# EAGLE design zap-1V5 (EAGLE 6.4)
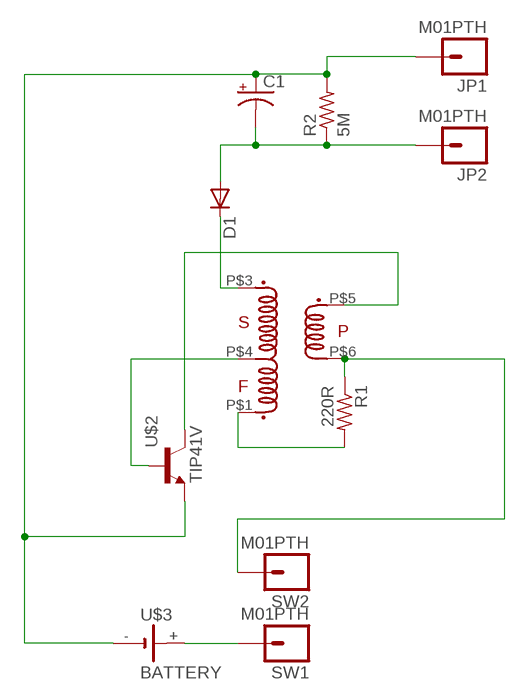
[diagram p0: schematic, sheet 1]

## Parts
C1  CAPACITOR_POL  [E5-10,5-SIDE]
D1  DIODEPTH  [DIODE-1N4001]
JP1  M01PTH  [1X01]
JP2  M01PTH  [1X01]
R1  220R  RESISTOR0207/2V  [0207/2V]
R2  5M  RESISTOR0207/7  [0207/7]
SW1  M01PTH  [1X01]
SW2  M01PTH  [1X01]
U$1  XFT-FLYBACK3V  [XFT-FLYBACK]
U$2  TIP41V  [TO220V]
U$3  BATTERY  [A90]

## Nets
N$1: C1.P$1(+) JP1.1 R2.2 U$2.3(E) U$3.-
N$2: C1.P$2(-) D1.A JP2.1 R2.1
N$3: D1.C U$1.P$3(P$1.S)
N$4: R1.1 SW2.1 U$1.P$6(P$5.P2)
N$5: SW1.1 U$3.+
N$6: R1.2 U$1.P$1(P$3.F)
N$7: U$1.P$4(P$2.CENTRE) U$2.1(B)
N$8: U$1.P$5(P$4.P1) U$2.2(C)

## Library data of the parts
C1 = iStivi - RCLD:CAPACITOR_POL: POLARIZED CAPACITOR, American symbol
D1 = iStivi - RCLD:DIODE: Diode These are standard reverse protection diodes and small signal diodes.
JP1 JP2 SW1 SW2 = iStivi - Header-Connector:M01: Header 1 Standard 1-pin 0.1" header. Use with straight break away headers (SKU : PRT-00116), right angle break away headers (PRT-00553), swiss pins (PRT-00743), machine pins (PRT-00117), and female headers (PRT-00115).
R1 R2 = iStivi - RCLD:RESISTOR: RESISTOR
U$1 = iStivi - Transformers:XFT-FLYBACK: XFT Flyback transformer
U$2 = iStivi - Transistor-FET-reg:TIP41: TIP41 NPN power transistor
U$3 = iStivi - Supply:BATTERY: Battery Battery footprints

## Board
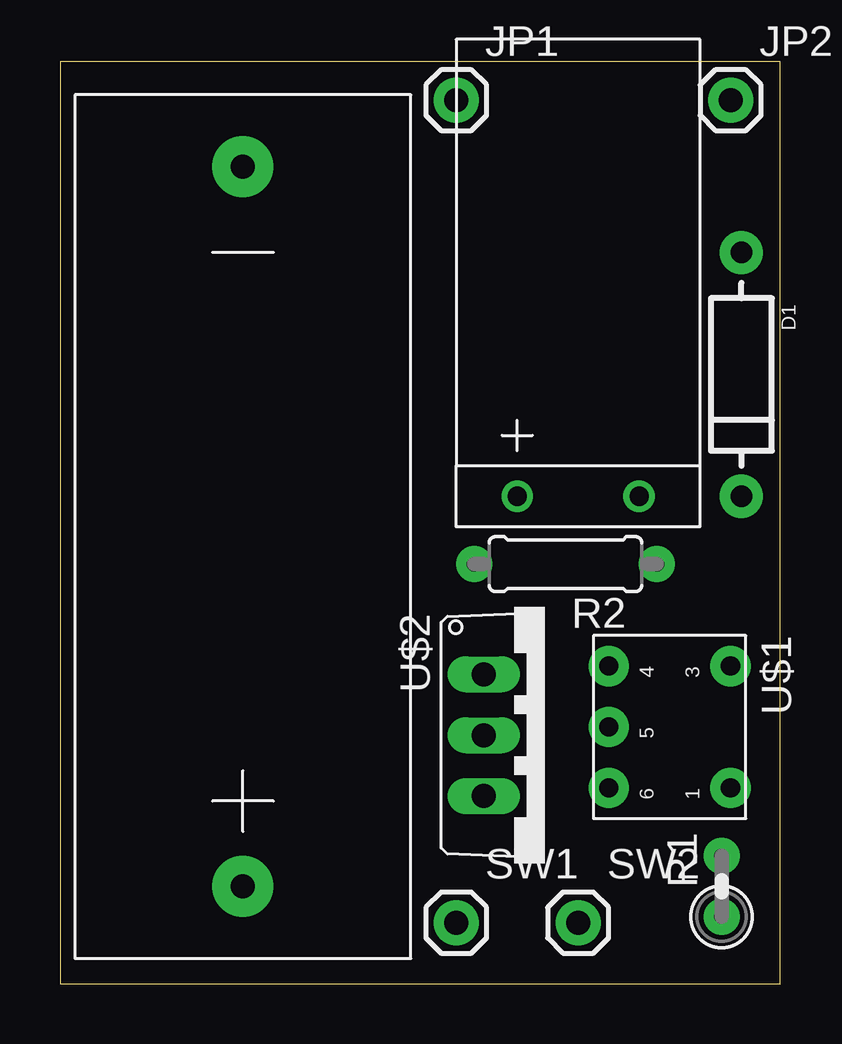
[diagram p1: board, top side]
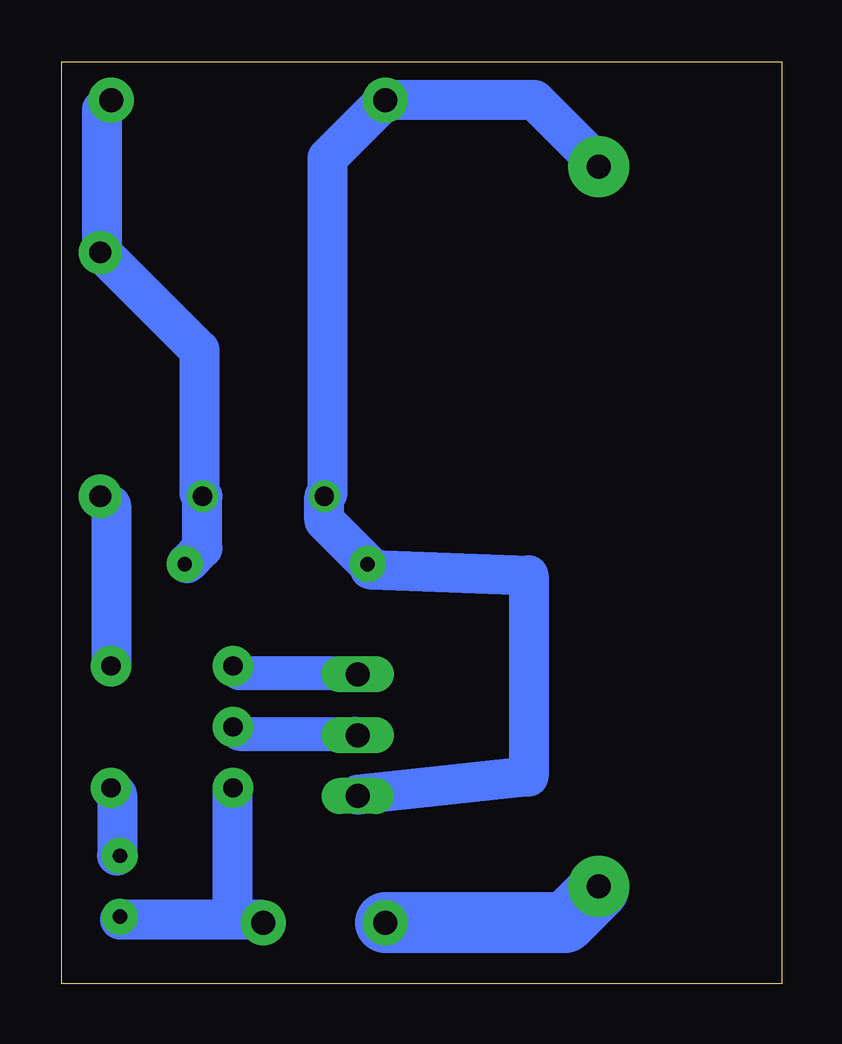
[diagram p2: board, bottom side, seen from below]

Size 30 x 38.43 mm. Coordinates in mm from the lower left corner, seen from the top.
Outline: 0,0 30,0 30,38.43 0,38.43 0,0
Copper layers (1*16): Top 0.035mm / dielectric 1.5mm / Bottom 0.035mm
Design rules "zap *": minimum track width 0.5mm, minimum drill 0.6mm, track to track 0.205mm, track to pad 0.205mm, pad to pad 0.205mm, via to via 0.205mm, smd to smd 8mil, copper to edge 0.3mm, drill to drill 8mil, minimum pad ring 10mil, minimum via ring 8mil, stop-mask expansion 4mil, vias tented up to drill 0mil, thermal gap 10mil

### Footprints (pad centres in the part's own frame; a part is rotated, then mirrored left to right if it is on the bottom)
E5-10,5-SIDE = drill 0.8: P$1 0,2.54; P$2 0,-2.54
DIODE-1N4001 = drill 0.9 pad 1.8: A -5.08,0; C 5.08,0
1X01 = drill 1 pad 1.88: 1 0,0
0207/2V = drill 0.6 pad 1.5: 1 -1.27,0; 2 1.27,0
0207/7 = drill 0.6 pad 1.5: 1 -3.81,0; 2 3.81,0
XFT-FLYBACK = drill 0.8 pad 1.676: P$1 2.54,2.54; P$3 -2.54,2.54; P$4 -2.54,-2.54; P$5 0,-2.54; P$6 2.54,-2.54
TO220V = drill 1 long: 1 -2.54,-2.54; 2 0,-2.54; 3 2.54,-2.54
A90 = drill 1 pad 2.54: + 0,15; - 0,-15

### Placement (x,y rotation side)
C1  21.59,20.32 90 top
D1  28.39,25.4 270 top
JP1  16.51,36.83 0 top
JP2  27.94,36.83 0 top
R1  27.57,4.06 90 top
R2  21.06,17.49 180 top
SW1  16.51,2.54 0 top
SW2  21.59,2.54 0 top
U$1  25.4,10.7 270 top
U$2  20.2,10.36 270 top
U$3  7.62,19.05 180 top

### Tracks (layer width: path | path; a pad name or v marks a point on that pad's centre or on a via)
N$1
  Bottom 0.5: 17.27,17.53 R2.2 17.14,17.27 | 17.65,7.87 U$2.3 | 7.62,34.16 U$3.-
  Bottom 1.422: 18.92,20.45 C1.P$1
  Bottom 1.676: C1.P$1 19.05,19.3 17.27,17.53 | 17.65,7.87 10.54,8.64 10.54,17.02 17.14,17.27 | 7.62,34.16 10.29,36.83 JP1.1 18.92,34.42 18.92,20.45
N$2
  Bottom 0.5: 24.77,17.53 R2.1 | JP2.1 28.32,36.45 | 28.32,30.48 D1.A 28.19,30.35 | 24.26,20.45 C1.P$2
  Bottom 1.676: C1.P$2 24.13,18.16 24.77,17.53 | 28.32,36.45 28.32,30.48 | 24.26,20.45 24.26,26.42 28.19,30.35
N$3
  Bottom 0.5: 28.32,20.32 27.94,19.94
  Bottom 1.676: 27.94,19.94 U$1.P$3 | 28.32,20.32 D1.C
N$4
  Bottom 0.5: 27.56,2.67 R1.1
  Bottom 1.422: SW2.1 21.72,2.67
  Bottom 1.676: 21.72,2.67 22.86,2.67 | 22.86,2.67 27.56,2.67 | 22.86,2.67 U$1.P$6
N$5
  Bottom 0.5: 7.62,3.94 U$3.+
  Bottom 2.54: SW1.1 9.02,2.54 7.62,3.94
N$6
  Bottom 0.5: 27.94,8.13 27.69,7.87 | 27.69,5.33 R1.2
  Bottom 1.676: 27.69,7.87 27.69,5.33 | 27.94,8.13 U$1.P$1
N$7
  Bottom 0.5: 22.61,12.95 22.86,13.21 U$1.P$4 | 17.78,12.95 U$2.1
  Bottom 1.422: 22.61,12.95 17.78,12.95
N$8
  Bottom 0.5: 22.61,10.41 22.86,10.67 U$1.P$5 | 17.78,10.41 U$2.2
  Bottom 1.422: 22.61,10.41 17.78,10.41